# EAGLE design YOTSUBA_-Y-Z_ver.1.2 (EAGLE 9.6.2)
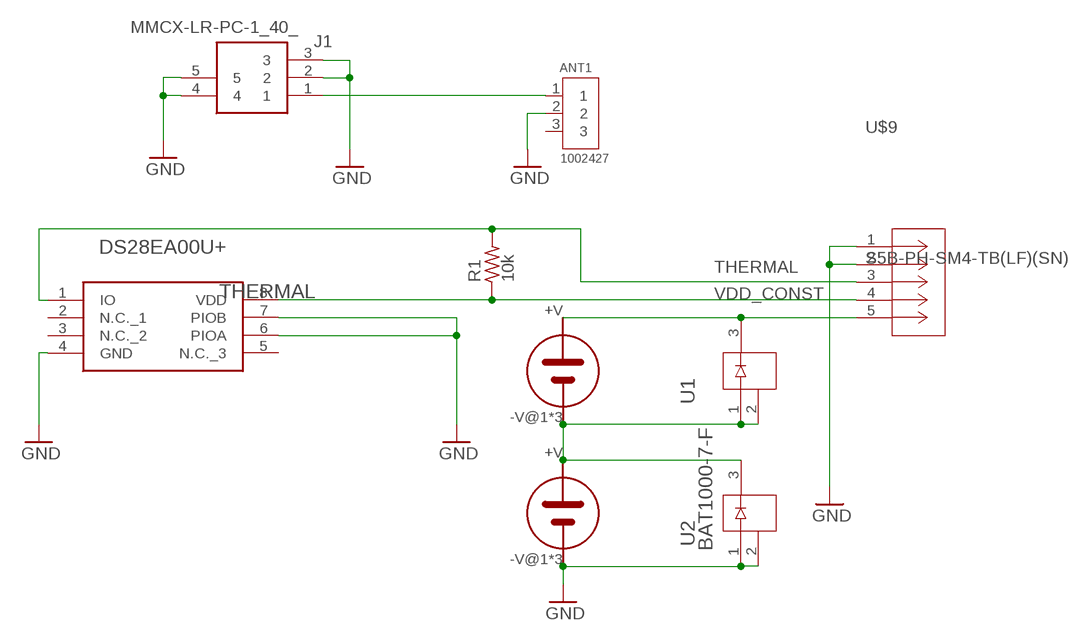
[diagram p0: schematic, sheet 1]

## Parts
ANT1  1002427  [ANTENNA_1002427]
J1  MMCX-LR-PC-1_40_  [MMCXLRPC140]
R1  10k  R-US_R0805  [R0805]
THERMAL  DS28EA00U+  [SOP65P490X110-8N]
U1  BAT1000-7-F  [SOT23_BAT_DIO]
U2  BAT1000-7-F  [SOT23_BAT_DIO]
U$2  3G30A  [SOLAR_3G30A]
U$3  3G30A  [SOLAR_3G30A]
U$9  S5B-PH-SM4-TB(LF)(SN)  [CONN_S5B-PH-SM4-TB_JST]

## Nets
GND [GND]: ANT1.2 J1.2 J1.3 J1.4 J1.5 THERMAL.4(GND) THERMAL.6(PIOA) THERMAL.7(PIOB) U2.1 U2.2 U$3.-V@1(-V) U$3.-V@2(-V) U$3.-V@3(-V) U$9.1 U$9.2
N$5: U1.1 U1.2 U2.3 U$2.-V@1(-V) U$2.-V@2(-V) U$2.-V@3(-V) U$3.+V
N$6: U1.3 U$2.+V U$9.5
RF2 [ANTENNA]: ANT1.1 J1.1
THERMAL: R1.2 THERMAL.1(IO) U$9.3
VDD_CONST: R1.1 THERMAL.8(VDD) U$9.4
Unconnected: ANT1.3 THERMAL.2(N.C._1) THERMAL.3(N.C._2) THERMAL.5(N.C._3)

## Library data of the parts
ANT1 = 1002427:1002427: RF ANT 868MHZ/915MHZ STAMPED MET; DESCRIPTION: 868MHz, 915MHz, 1.575GHz Beidou, GLONASS, GPS, ISM, LoRa, LPWAN, Sigfox Stamped Metal RF Antenna 868MHz, 915MHz, 1.561GHz ~ 1.602GHz 3dBi Solder Surface Mount; DIGI-KEY_PART_NUMBER: 478-1002427TR-ND; MF: Ethertronics/AVX; MP: 1002427; PACKAGE: None; PURCHASE-URL: https://pricing.snapeda.com/search/part/1002427/?ref=eda
J1 = MMCX-LR-PC-1_40_:MMCX-LR-PC-1_40_: RF Connectors / Coaxial Connectors MINI PUSH-ON CONN RECEPT RA Source: Datasheet <https://componentsearchengine.com/Datasheets/1/MMCX-LR-PC-1(40).pdf>; DESCRIPTION: RF Connectors / Coaxial Connectors MINI PUSH-ON CONN RECEPT RA; HEIGHT: 3.95mm; MANUFACTURER_NAME: Hirose; MANUFACTURER_PART_NUMBER: MMCX-LR-PC-1(40); MOUSER_PART_NUMBER: 798-MMCX-LR-PC-1(40); MOUSER_PRICE-STOCK: https://www.mouser.co.uk/ProductDetail/Hirose-Connector/MMCX-LR-PC-140?qs=XQjbzJWzFPVvtPijmLd%2FXQ%3D%3D
R1 = rcl:R-US_: RESISTOR, American symbol; SPICEPREFIX: R
THERMAL = DS28EA00U+:DS28EA00U+: Maxim DS28EA00U+ Temperature Sensor 8-Pin uMAX, -40 +85 C Source: Datasheet <https://datasheets.maximintegrated.com/en/ds/DS28EA00.pdf>; ARROW_PART_NUMBER: DS28EA00U+; ARROW_PRICE-STOCK: https://www.arrow.com/en/products/ds28ea00u/maxim-integrated?region=nac; DESCRIPTION: Maxim DS28EA00U+ Temperature Sensor 8-Pin uMAX, -40 +85 C; HEIGHT: 1.1mm; MANUFACTURER_NAME: Analog Devices; MANUFACTURER_PART_NUMBER: DS28EA00U+; MOUSER_PART_NUMBER: 700-DS28EA00U; MOUSER_PRICE-STOCK: https://www.mouser.co.uk/ProductDetail/Maxim-Integrated/DS28EA00U%2b?qs=7H2Jq%252ByxpJJHHt%2F9DIHuNA%3D%3D
U1 U2 = BAT1000:BAT1000-7-F; COPYRIGHT: Copyright (C) 2023 Ultra Librarian. All rights reserved.; DIGIKEY_PART_NUMBER_1: BAT1000-7FDITR-ND; DIGIKEY_PART_NUMBER_2: BAT1000-7FDICT-ND; DIGIKEY_PART_NUMBER_3: BAT1000-7FDIDKR-ND; MANUFACTURER_PART_NUMBER: BAT1000-7-F; MFR_NAME: Diodes Inc
U$2 U$3 = 3G30A_normal:3G30A
U$9 = S5B-PH-SM4:S5B-PH-SM4-TB(LF)(SN); COPYRIGHT: Copyright (C) 2023 Ultra Librarian. All rights reserved.; DIGIKEY_PART_NUMBER_1: 455-1752-2-ND; DIGIKEY_PART_NUMBER_2: 455-1752-1-ND; DIGIKEY_PART_NUMBER_3: 455-1752-6-ND; MANUFACTURER_PART_NUMBER: S5B-PH-SM4-TB(LF)(SN); MFR_NAME: JST

## Net classes
2 GND: clearance 0.5 mm to class 0, clearance 0.1 mm to class 1, clearance 0.5 mm

## Board
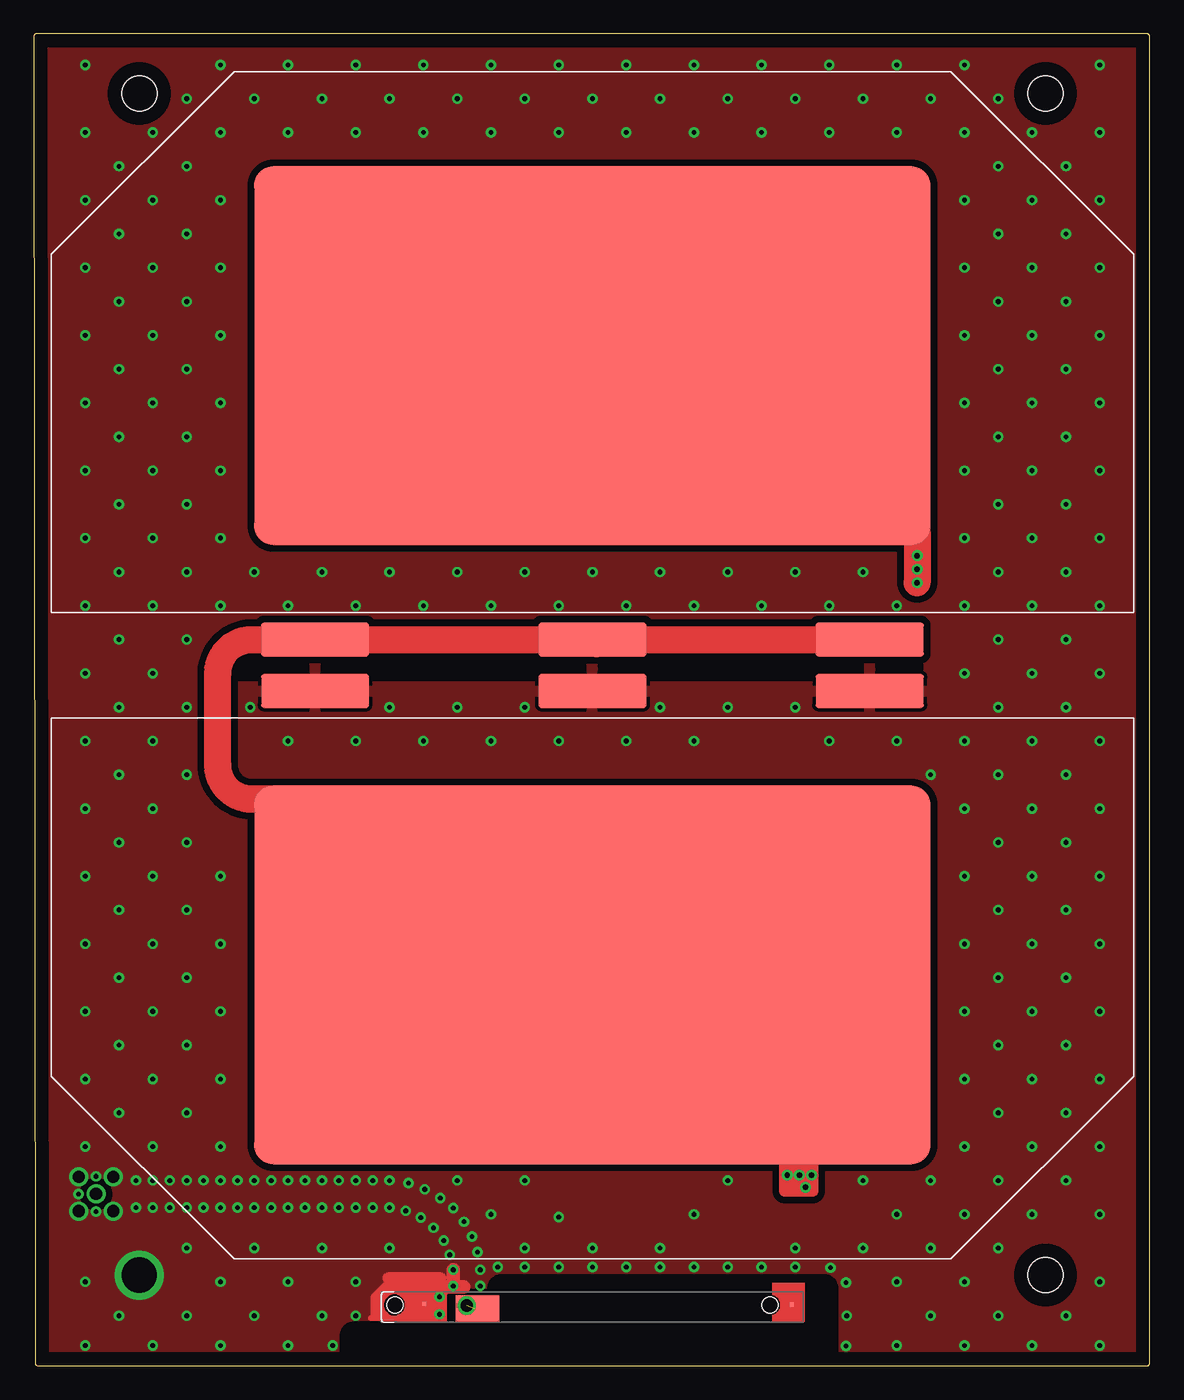
[diagram p1: board, top side]
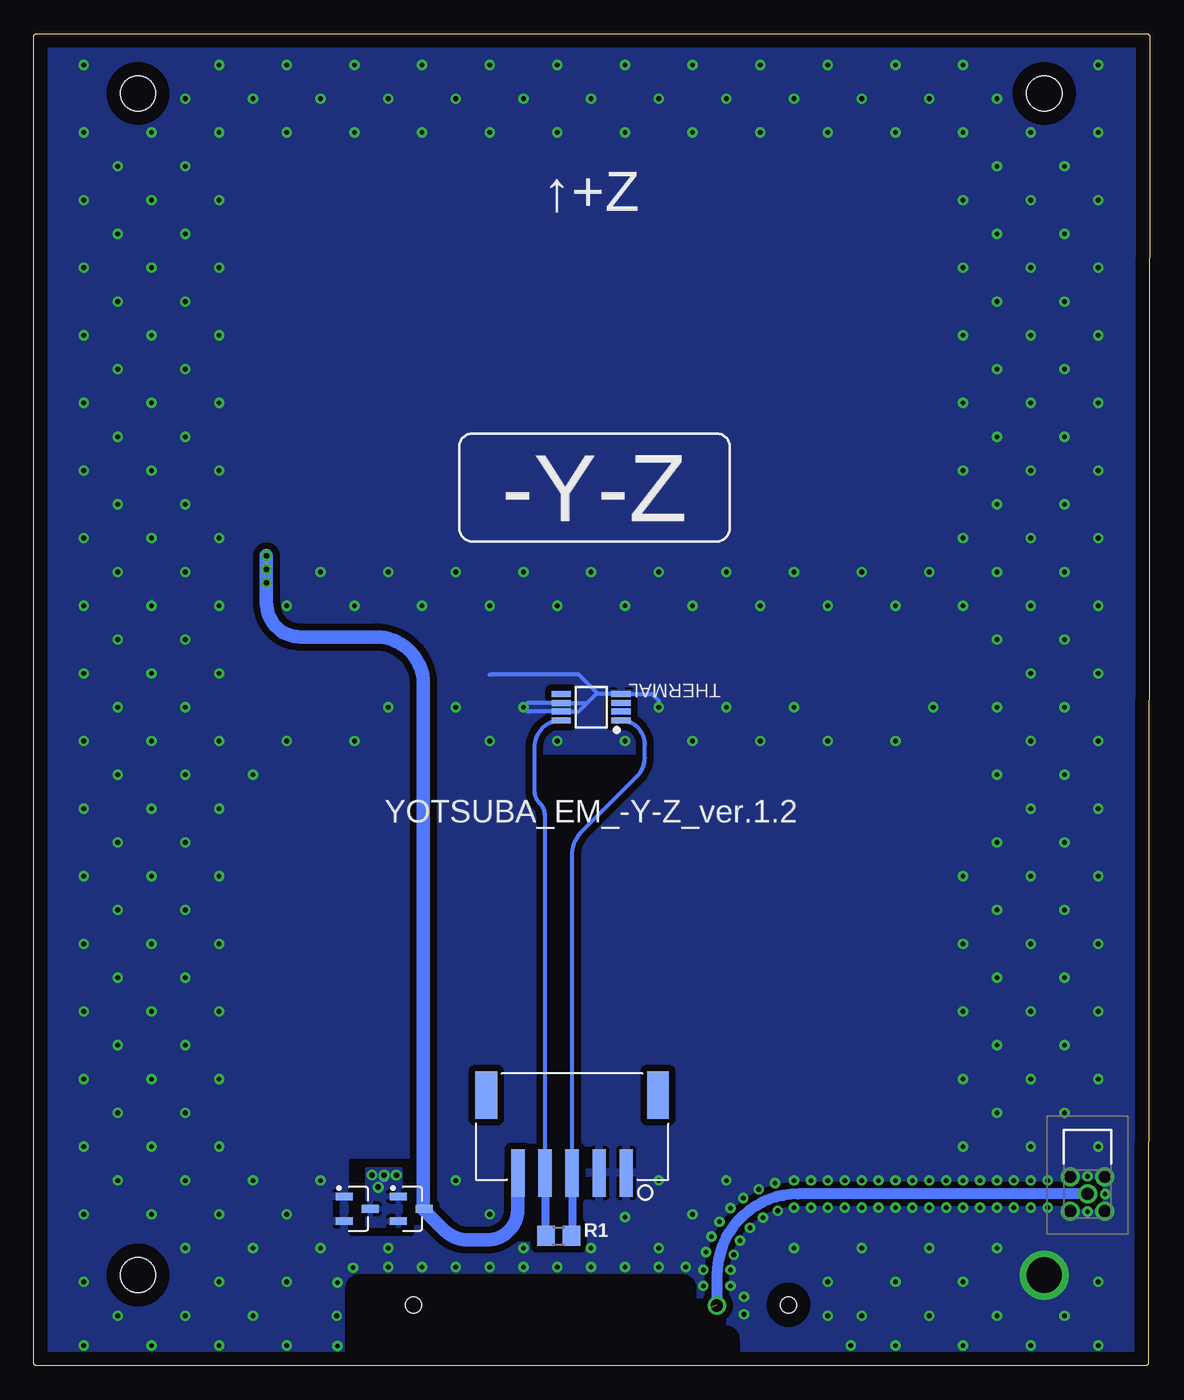
[diagram p2: board, bottom side, seen from below]

Size 82.5 x 98.5 mm. Coordinates in mm from the lower left corner, seen from the top.
Outline: 0.3,0 82.3,0 arc90 82.5,0.2 82.5,98.3 arc90 82.3,98.5 0.2,98.5 arc90 0,98.3 0.1,0.2 arc90 0.3,0
Copper layers (1*16): Top 0.035mm / dielectric 1.2mm / Bottom 0.035mm
Design rules "default *": minimum track width 6mil, minimum drill 0.35mm, track to track 6mil, track to pad 6mil, pad to pad 6mil, via to via 6mil, smd to smd 6mil, copper to edge 40mil, drill to drill 6mil, minimum pad ring 10mil, minimum via ring 8mil, stop-mask expansion 4mil, vias tented up to drill 30mil, thermal gap 10mil
Holes 2.6 mm at 74.8,6.7 7.8,94.1 74.8,94.1
tRestrict: 12 lines
bRestrict: 17 lines

### Footprints (pad centres in the part's own frame; a part is rotated, then mirrored left to right if it is on the bottom)
ANTENNA_1002427 = smd 3.2 x 1.9: 1 24.1,-1.05 | smd 0.3 x 0.3: 2 28.02,-1.375; 3 0.875,-1.325 | hole 1.2: 2.46,-1.3; 30.2,-1.3
MMCXLRPC140 = drill 0.9 pad 1.4: 1 0,0; 2 -1.27,-1.27; 3 1.27,-1.27; 4 1.27,1.27; 5 -1.27,1.27
R0805 = smd 1.3 x 1.5: 1 -0.95,0; 2 0.95,0
SOP65P490X110-8N = smd 1.425 x 0.45: 1 -2.212,0.975; 2 -2.212,0.325; 3 -2.212,-0.325; 4 -2.212,-0.975; 5 2.212,-0.975; 6 2.212,-0.325; 7 2.212,0.325; 8 2.212,0.975
SOT23_BAT_DIO = smd 0.568 x 1.259: 1 -0.915,-0.965; 2 0.915,-0.965; 3 0,0.965
SOLAR_3G30A = smd 50 x 28: +V 0,19 | smd 8 x 2.5: -V@1 -20.5,-2; -V@2 20.5,-2; -V@3 0,-2
CONN_S5B-PH-SM4-TB_JST = smd 0.991 x 3.505: 1 4,-3.453; 2 2,-3.453; 3 0,-3.453; 4 -2,-3.453; 5 -4,-3.453 | smd 1.6 x 3.505: 6 -6.35,2.297; 7 6.35,2.297

### Placement (x,y rotation side)
ANT1  56.9,3.2 180 top
J1  4.6,12.7 90 bottom
R1  43.7,9.6 0 bottom
THERMAL  41.3,48.7 180 bottom
U1  54.6,11.6 270 bottom
U2  58.6,11.6 270 bottom
U$2  41.3,55.7 0 top
U$3  41.3,47.9 180 top
U$9  42.7,17.7 0 bottom

### Tracks (layer width: path | path; a pad name or v marks a point on that pad's centre or on a via)
GND  (via drill 0.35, 2.6)
  Top 0.2: ANT1.2 29.34,3.5
  Top 0.4: 29.34,3.5 24.9,3.5 | 25.4,3.8 26,3.8
  Top 0.8: ANT1.2 30.1,4.58 30.1,6.5 26.9,6.5 | 26.9,6.5 26.2,6.5 | 26.9,6.5 26.9,5.7 26.1,5.7
  Top 1: 25.4,5 25.4,3.8 | 31.8,5.85 30.75,5.85 arc90 v30,5.1 | v31,7.1 v31,5.9
  Top 1.016: 26.1,5.7 25.4,5
  Bottom 0.3: 48.8,51.1 42.2,51.1 40.85,49.75 | 40.85,49.75 40.77,49.67 THERMAL.4 36.82,49.67 36.8,49.7 36.3,49.2 v36.3,48.7 | 41.6,49 40.85,49.75 | 41.6,49 43.41,49 THERMAL.6 45.97,49.02 v46.3,48.7 45.97,48.38 THERMAL.7 42.22,48.38 41.6,49
  other vias: 34.3,7.3 43.8,46.2 33.8,46.2 31.3,48.7 26.3,48.7 28.8,46.2 23.8,46.2 18.8,46.2 16,48.7 38.8,46.2 51.3,48.7 48.8,46.2 56.3,48.7 58.8,46.2 63.8,46.2 66.3,43.7 68.8,46.2 71.3,43.7 73.8,46.2 71.3,48.7 68.8,51.2 73.8,51.2 78.8,51.2 76.3,48.7 78.8,46.2 76.3,43.7 78.8,41.2 73.8,41.2 68.8,41.2 71.3,38.7 68.8,36.2 73.8,36.2 76.3,38.7 78.8,36.2 76.3,33.7 71.3,33.7 73.8,31.2 78.8,31.2 76.3,28.7 71.3,28.7 68.8,31.2 68.8,26.2 73.8,26.2 78.8,26.2 76.3,23.7 71.3,23.7 68.8,21.2 73.8,21.2 78.8,21.2 76.3,18.7 71.3,18.7 68.8,16.2 73.8,16.2 78.8,16.2 71.3,13.7 66.3,13.7 76.3,13.7 78.8,11.2 78.8,6.2 73.8,11.2 68.8,11.2 63.8,11.2 61.3,13.7 61.3,8.7 66.3,8.7 71.3,8.7 68.8,6.2 63.8,6.2 60.1,3.7 63.8,1.5 66.3,3.7 71.3,3.7 68.8,1.5 73.8,1.5 76.3,3.7 78.8,1.5 56.3,8.7 46.3,8.7 41.3,8.7 38.8,11 36.3,8.7 33.8,11.2 36.3,13.7 31.3,13.7 23.8,11.7 21.3,13.7 16.3,13.7 21.3,8.7 16.3,8.7 48.8,11.2 51.3,13.7 13.8,16.2 8.8,16.2 11.3,18.7 6.3,18.7 8.8,21.2 13.8,21.2 11.3,23.7 6.3,23.7 3.8,21.2 8.8,26.2 13.8,26.2 11.3,28.7 6.3,28.7 3.8,26.2 3.8,31.2 8.8,31.2 13.8,31.2 11.3,33.7 6.3,33.7 8.8,36.2 13.8,36.2 11.3,38.7 6.3,38.7 3.8,36.2 3.8,41.2 8.8,41.2 6.3,43.7 3.8,46.2 8.8,46.2 11.3,43.7 6.3,48.7 11.3,48.7 8.8,51.2 3.8,51.2 6.3,53.7 3.8,56.2 8.8,56.2 11.3,53.7 13.8,56.2 11.3,58.7 6.3,58.7 3.8,61.2 8.8,61.2 13.8,61.2 16.3,58.7 21.3,58.7 18.8,56.2 23.8,56.2 26.3,58.7 28.8,56.2 31.3,58.7 33.8,56.2 36.3,58.7 38.8,56.2 41.3,58.7 46.3,58.7 43.8,56.2 48.8,56.2 51.3,58.7 53.8,56.2 56.3,58.7 58.8,56.2 61.3,58.7 63.8,56.2 68.8,56.2 71.3,53.7 73.8,56.2 71.3,58.7 76.3,53.7 78.8,56.2 76.3,58.7 78.8,61.2 73.8,61.2 68.8,61.2 71.3,63.7 76.3,63.7 78.8,66.2 73.8,66.2 68.8,66.2 71.3,68.7 76.3,68.7 78.8,71.2 73.8,71.2 71.3,73.7 68.8,71.2 76.3,73.7 73.8,76.2 68.8,76.2 71.3,78.7 76.3,78.7 78.8,76.2 6.3,63.7 3.8,66.2 8.8,66.2 11.3,63.7 13.8,66.2 11.3,68.7 6.3,68.7 3.8,71.2 8.8,71.2 13.8,71.2 11.3,73.7 6.3,73.7 8.8,76.2 3.8,76.2 6.3,78.7 3.8,81.2 13.8,76.2 11.3,78.7 8.8,81.2 13.8,81.2 11.3,83.7 6.3,83.7 3.8,86.2 8.8,86.2 13.8,86.2 11.3,88.7 6.3,88.7 3.8,91.2 3.8,96.2 8.8,91.2 13.8,91.2 11.3,93.7 13.8,96.2 16.3,93.7 18.8,96.2 18.8,91.2 21.3,93.7 23.8,96.2 26.3,93.7 23.8,91.2 28.8,91.2 28.8,96.2 31.3,93.7 33.8,91.2 33.8,96.2 36.3,93.7 38.8,96.2 38.8,91.2 41.3,93.7 43.8,96.2 43.8,91.2 46.3,93.7 48.8,96.2 48.8,91.2 56.3,93.7 51.3,93.7 53.8,96.2 53.8,91.2 58.8,96.2 61.3,93.7 58.8,91.2 63.8,91.2 66.3,93.7 63.8,96.2 68.8,96.2 71.3,93.7 68.8,91.2 73.8,91.2 71.3,88.7 68.8,86.2 68.8,81.2 71.3,83.7 73.8,81.2 76.3,83.7 73.8,86.2 76.3,88.7 78.8,86.2 78.8,81.2 78.8,91.2 78.8,96.2 18.8,1.5 13.8,1.5 8.8,1.5 11.3,3.7 6.3,3.7 3.8,1.5 3.8,6.2 30,3.8 11.3,13.7 7.8,6.7 3.8,16.2 13.8,13.7 12.55,13.7 15.05,13.7 10.05,13.7 8.8,13.7 7.55,13.7 17.55,13.7 18.8,13.7 20.05,13.7 22.55,13.7 23.8,13.7 22.55,11.7 21.3,11.7 20.05,11.7 18.8,11.7 17.55,11.7 16.3,11.7 15.05,11.7 13.8,11.7 12.55,11.7 11.3,11.7 10.05,11.7 8.8,11.7 7.55,11.7 4.6,14 3.3,12.7 4.6,11.4 16.3,3.7 21.3,3.7 18.8,6.2 13.8,6.2 11.3,8.7 23.8,6.2 26.3,8.7 36.3,7.3 41.3,7.3 46.3,7.3 51.3,7.3 56.3,7.3 60.05,1.45 60.05,6.15 23.8,3.7 22.1,1.5 33,5.9 33,7.1 25.05,13.7 25.05,11.7 26.3,11.7 26.3,13.7 27.7,13.5 27.5,11.45 28.6,10.95 29.55,10.2 30.3,9.25 30.75,8.2 28.9,13.05 30.05,12.4 31,11.65 31.8,10.65 32.4,9.55 32.8,8.4 38.8,7.3 43.8,7.3 48.8,7.3 53.8,7.3 58.9,7.25
  pour Top: 88.65,102.6 -4.35,102.6 arc90 -4.6,102.35 -4.6,-6.15 arc90 -3.85,-6.9 88.9,-6.9 88.9,102.35 arc90
  pour Bottom: -4.9,-5.6 -4.9,103.1 arc-90 -3.9,104.1 86.3,104.1 arc-90 87.3,103.1 87.3,-5.6 arc-90 86.3,-6.6 -3.9,-6.6 arc-90
N$5  (via drill 0.4)
  Top 0.8: U$3.+V 57.6,28.9 57.6,12.9 55.5,12.9 55.5,14.4 | 55.5,14.4 55.5,15 57.2,15 57.2,14.4 v57.5,14.1 57.2,13.8 | 56.6,14 56,14 56,13.1 56.6,13.1 56.6,13.2 | v56.6,14.1 56.6,13.2 | v56.6,14.1 56.6,14.4 55.5,14.4 | v56.6,14.1 56.9,13.8 57.2,13.8 | 57.2,13.8 57.2,13.4 v57.05,13.2 56.6,13.2
  Top 2: U$2.-V@3 41.6,53.4 41.8,53.6 | 41.8,53.6 41.5,53.6 U$2.-V@3 | U$3.+V 21.6,28.9 21.6,41.9 16.1,41.9 arc-90 13.6,44.4 13.6,51.2 arc-90 16.1,53.7 U$2.-V@1 41.8,53.7 41.8,53.6 | U$2.-V@3 U$2.-V@2 | U$2.-V@2 62.8,53.7 | 62.8,53.8 61.8,53.8 U$2.-V@2
  Bottom 0.8: v56.6,14.1 56.6,14
  other vias: 55.7,14.1
  pour Bottom: 55.4,14.5 57.8,14.5 57.8,10.4 55.4,10.4
N$6  (via drill 0.4)
  Top 2: U$2.+V 41.59,74.7 54.3,61.7 65.3,61.7 v65.3,57.9
  Bottom 1: v65.3,59.9 v65.3,58.9 v65.3,57.9 65.3,56.4 arc-90 62.8,53.9 57.2,53.9 arc90 53.7,50.4 53.7,11.6 U1.3 53.63,11.5 52.14,10.01 arc-45 50.43,9.3 49.01,9.3 arc-90 46.71,11.6 46.71,14.24 U$9.5
RF2  (via drill 0.9)  (1 unrouted)
  Top 0.8: v32,4.45 31.6,4.45 | ANT1.1 32.6,4.25
  Bottom 0.8: J1.1 26,12.7 arc-90 32,6.7 v32,4.45
THERMAL
  Bottom 0.3: U$9.3 42.71,37.75 arc45 41.98,39.52 37.89,43.61 arc-45 37.33,44.97 37.33,45.89 arc-90 THERMAL.1 | 42.71,9.8 R1.2
  Bottom 0.6: U$9.3 42.71,14.24 42.71,9.8
VDD_CONST
  Bottom 0.3: THERMAL.8 THERMAL.8 arc-90 45.5,45.73 45.5,42.53 arc-45 45.12,41.62 45.05,41.55 arc45 44.71,40.72 44.7,40.71 44.7,14.4 U$9.4 | 44.71,9.82 R1.1
  Bottom 0.6: 44.7,14.4 44.7,9.65 R1.1
(copper drawn outside any net)
  shapes: Top circle x1

### Text on the board
bNames: ↑+Z | -Y-Z | YOTSUBA_EM_-Y-Z_ver.1.2